# Altium schematic sheet DSO_Control.SchDoc: Schematic_Name
size A4; CompanyName: University of Melbourne; Engineer: Your Name Here; DocumentNumber: 1; Revision: 0.1; SheetNumber: 1; SheetTotal: 1; Title_Project: Project_Title; StudentNo: Student No.
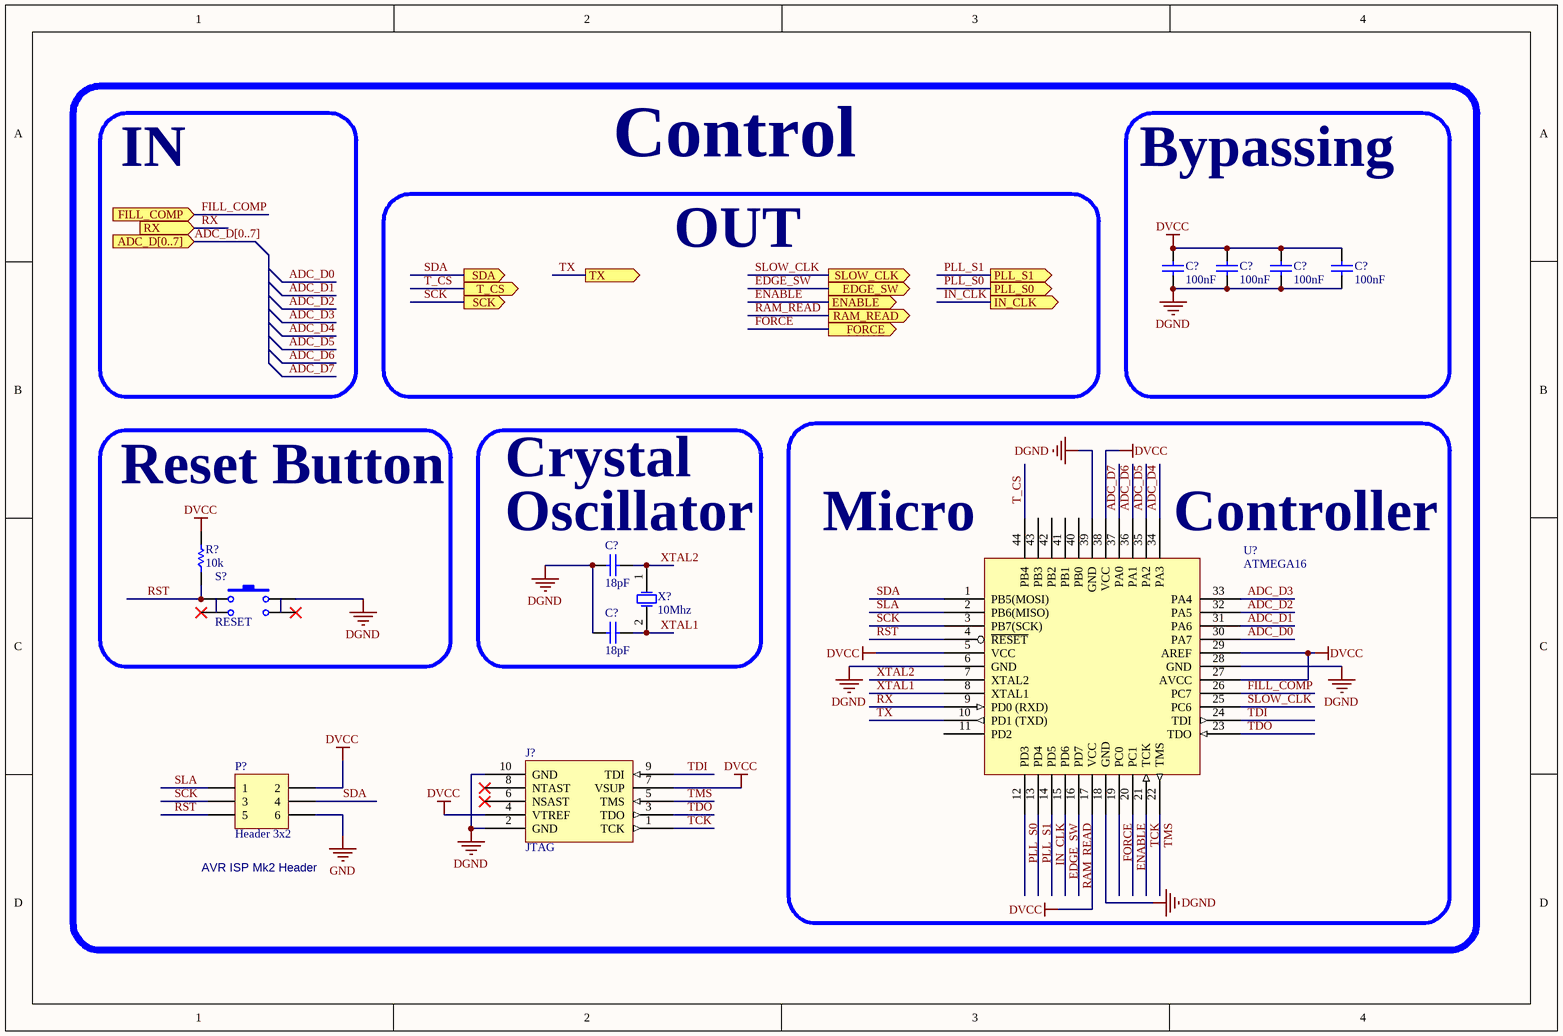
[diagram p0: DSO_Control.SchDoc]

## Parts
(Parts that share a designator on the sheet are numbered #1, #2 ... from top to bottom, then left to right.)
C?#1  100nF  [0805C]
C?#2  100nF  [0805C]
C?#3  100nF  [0805C]
C?#4  100nF  [0805C]
C?#5  18pF  [0805C]
C?#6  18pF  [0805C]
J?  JTAG  [BOXEDVERT10]
P?  Header 3x2  [HDR3x2]
R?  10k  [0805]
S?  RESET  [SPST PB SWITCH SMD]
U?  ATMEGA16  [QFP-48]
X?  10Mhz  [XTAL_FLAT_SMD]

## Blocks framed on the sheet
Control: C?#5 C?#6 J? P? U? X?
Bypassing: C?#1-C?#4
Reset Button: R? S?

## Ports
ADC_D[0..7] (in), EDGE_SW (out), ENABLE (out), FILL_COMP (in), FORCE (out), IN_CLK (out), PLL_S0 (out), PLL_S1 (out), RAM_READ (out), RX (in), SCK (out), SDA (out), SLOW_CLK (out), T_CS (out), TX (out)

## Nets
DGND: C?#1.2 C?#2.2 C?#3.2 C?#4.2 C?#5.2 C?#6.2 J?.2(GND) J?.10(GND) S?.2 U?.6(GND) U?.18(GND) U?.28(GND) U?.39(GND)
DVCC: C?#1.1 C?#2.1 C?#3.1 C?#4.1 J?.4(VTREF) J?.7(VSUP) P?.2 R?.2 U?.5(VCC) U?.17(VCC) U?.27(AVCC) U?.29(AREF) U?.38(VCC)
GND: P?.6
ADC_D0: U?.30(PA7)
ADC_D1: U?.31(PA6)
ADC_D2: U?.32(PA5)
ADC_D3: U?.33(PA4)
ADC_D4: U?.34(PA3)
ADC_D5: U?.35(PA2)
ADC_D6: U?.36(PA1)
ADC_D7: U?.37(PA0)
EDGE_SW: U?.15(PD6) ; port EDGE_SW
ENABLE: U?.20(PC1) ; port ENABLE
FILL_COMP: U?.26(PC7) ; port FILL_COMP
FORCE: U?.19(PC0) ; port FORCE
IN_CLK: U?.14(PD5) ; port IN_CLK
PLL_S0: U?.12(PD3) ; port PLL_S0
PLL_S1: U?.13(PD4) ; port PLL_S1
RAM_READ: U?.16(PD7) ; port RAM_READ
RST: P?.5 R?.1 S?.1 U?.4(~{RESET})
RX: U?.9(PD0_(RXD)) ; port RX
SCK: P?.3 U?.3(PB7(SCK)) ; port SCK
SDA: P?.4 U?.1(PB5(MOSI)) ; port SDA
SLA: P?.1 U?.2(PB6(MISO))
SLOW_CLK: U?.25(PC6) ; port SLOW_CLK
T_CS: U?.44(PB4) ; port T_CS
TCK: J?.1(TCK) U?.21(TCK)
TDI: J?.9(TDI) U?.24(TDI)
TDO: J?.3(TDO) U?.23(TDO)
TMS: J?.5(TMS) U?.22(TMS)
TX: U?.10(PD1_(TXD)) ; port TX
XTAL1: C?#6.1 U?.8(XTAL1) X?.2(OSC2)
XTAL2: C?#5.1 U?.7(XTAL2) X?.1(OSC1)

Not connected (* = marked no-connect by the designer): J? 6(NSAST)* 8(NTAST)*; S? 3* 4*; U? 11(PD2) 40(PB0) 41(PB1) 42(PB2) 43(PB3)

## Buses and harness runs
bus ADC_D[0..7] = port ADC_D[0..7]

## Notes on the sheet
- IN
- OUT
- Crystal
- (near C?#5) Oscillator
- (near U?) Micro
- (near U?) Controller
- (near P?) AVR ISP Mk2 Header

## Library data of the parts
C?#1-C?#6 = C: Capacitor; Reviewed by: RM - 2018/08/05; Revision: July-2002: Re-released for DXP Platform.; Supplier 1: *; Supplier Part Number 1: *
  C?#1-C?#4: Value: 100nF
  C?#5 C?#6: Value: 18pF
J? = JTAG_CON: Reviewed by: RM - 2018/08/05; Supplier 1: Digi-Key; Supplier Part Number 1: OR896-ND
P? = Header 3x2: Header, 5-Pin; Reviewed by: RM - 2018/08/05; Supplier 1: Digi-Key; Supplier Part Number 1: 952-2121-ND
R? = R: Resistor; Reviewed by: RM - 2018/08/05; Value: 10k; Supplier 1: *; Suppler Part Number 1: *
S? = SW_PB_1P1T4: Momentary Push Button Switch 1P 1T 2pins; Reviewed by: RM - 2018/08/05; Revision: July-2002: Re-released for DXP Platform.; Supplier 1: Digi-Key; Supplier Part Number 1: CKN9085CT-ND
U? = ATMEGA16: ATMEGA16 Microcontroller; Reviewed by: RM - 2018/08/05; Supplier 1: Digi-Key; Supplier Part Number 1: ATMEGA16A-AU-ND
X? = XTAL: Crystal Oscillator; Reviewed by: RM - 2018/08/05; Revision: July-2002: Re-released for DXP Platform.; Supplier 1: Digi-Key; Supplier Part Number 1: 887-1080-1-ND